# Altium project ESP32RemoteController.PrjPcb
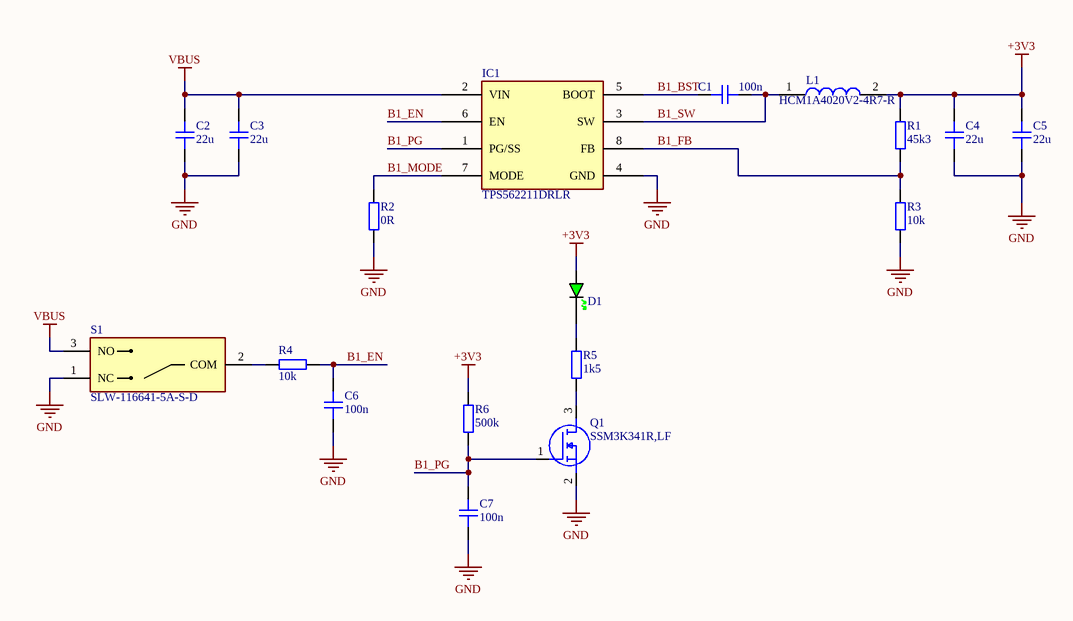
[diagram p0: Power.SchDoc]
3 sheets, 77 parts. Net scope: global (net labels, ports and power ports of the same name join across sheets).
Board file: RemoteControllerDesign.PcbDoc
Sheets:
  Power.SchDoc
  SoC.SchDoc
  Connections.SchDoc

## Sheet Power.SchDoc
size A4; SheetNumber: 1; SheetTotal: 3

### Parts
C1  100n  [CAP_0402]
C2  22u  [CAP_0603]
C3  22u  [CAP_0603]
C4  22u  [CAP_0603]
C5  22u  [CAP_0603]
C6  100n  [CAP_0402]
C7  100n  [CAP_0402]
D1  GREEN  [LED_0603_GREEN]  (value not drawn)
IC1  TPS562211DRLR  [SOTFL50P160X60-8N]
L1  HCM1A4020V2-4R7-R  [INDPM4442X200N]
Q1  SSM3K341R,LF  [SOTFL95P240X88-3N]
R1  45k3  [RES_0402]
R2  0R  [RES_0402]
R3  10k  [RES_0402]
R4  10k  [RES_0402]
R5  1k5  [RES_0603]
R6  500k  [RES_0402]
S1  SLW-116641-5A-S-D  [SLW1166415ASD]

### Nets
+3V3: C4.2 C5.2 D1.A L1.2 R1.2 R6.2
GND: C2.1 C3.1 C4.1 C5.1 C6.2 C7.2 IC1.4(GND) Q1.2(S) R2.1 R3.1 S1.1(NC)
VBUS: C2.2 C3.2 IC1.2(VIN) S1.3(NO)
B1_BST: C1.2 IC1.5(BOOT)
B1_EN: C6.1 IC1.6(EN) R4.1
B1_FB: IC1.8(FB) R1.1 R3.2
B1_MODE: IC1.7(MODE) R2.2
B1_PG: C7.1 IC1.1(PG/SS) Q1.1(G) R6.1
B1_SW: C1.1 IC1.3(SW) L1.1
NetD1_K: D1.K R5.2
NetQ1_3: Q1.3(D) R5.1
NetR4_2: R4.2 S1.2(COM)

### Library data of the parts
C1 C6 C7 = CAP_0402: Capacitor SMD 0402; Manufacturer: *; Manufacturer Part Number: *; Distributor Link: *; LCSC: *; Rating: *; Dielectric: *
C2-C5 = CAP_0603: Capacitor SMD 0603; Manufacturer: *; Manufacturer Part Number: *; Distributor Link: *; LCSC: *; Rating: *; Dielectric: *
D1 = LED_0603_GREEN: LED 0603 GREEN SMD
IC1 = TPS562211DRLR: Integrated Circuit; Manufacturer_Name: Texas Instruments; Datasheet Link: https://www.ti.com/lit/gpn/tps562211?HQS=ti-null-null-sf-df-pf-sep-wwe&DCM=yes; Height: 0.6mm; Manufacturer_Part_Number: TPS562211DRLR; Mouser Part Number: 595-TPS562211DRLR; Mouser Price/Stock: https://www.mouser.co.uk/ProductDetail/Texas-Instruments/TPS562211DRLR?qs=QNEnbhJQKvbGZDTBa5sjbg%3D%3D
L1 = HCM1A4020V2-4R7-R: Inductor; Manufacturer_Name: Eaton; Datasheet Link: https://www.eaton.com/content/dam/eaton/products/electronic-components/resources/data-sheet/eaton-hcm1a4020v2-automotive-power-inductor-data-sheet.pdf; Height: 2mm; Manufacturer_Part_Number: HCM1A4020V2-4R7-R; Mouser Part Number: 504-HCM1A4020V24R7-R; Mouser Price/Stock: https://www.mouser.co.uk/ProductDetail/Coiltronics-Eaton/HCM1A4020V2-4R7-R?qs=XeJtXLiO41Tld1UV9xSCUQ%3D%3D; Arrow Part Number: HCM1A4020V2-4R7-R; Arrow Price/Stock: https://www.arrow.com/en/products/hcm1a4020v2-4r7-r/eaton?region=nac
Q1 = SSM3K341R,LF: MOSFET (N-Channel); Manufacturer_Name: Toshiba; Datasheet Link: https://toshiba.semicon-storage.com/info/docget.jsp?did=35714&prodName=SSM3K341R; Height: 0.88mm; Manufacturer_Part_Number: SSM3K341R,LF; Mouser Part Number: 757-SSM3K341RLF; Mouser Price/Stock: https://www.mouser.co.uk/ProductDetail/Toshiba/SSM3K341RLF?qs=PDgMCp4xDJYlECuIdOFceQ%3D%3D; Arrow Part Number: SSM3K341R,LF; Arrow Price/Stock: https://www.arrow.com/en/products/ssm3k341rlf/toshiba?region=nac
R1-R4 R6 = RES_0402: Resistor SMD 0402; Manufacturer: *; Manufacturer Part Number: *; Distributor Link: *; LCSC: *
R5 = RES_0603: Resistor SMD 0603; Manufacturer: *; Manufacturer Part Number: *; Distributor Link: *; LCSC: *
S1 = SLW-116641-5A-S-D: Switch; Manufacturer_Name: Same Sky; Datasheet Link: https://www.sameskydevices.com/product/resource/supplyframepdf/slw-116641-5a-s-d.pdf; Height: 11.3mm; Manufacturer_Part_Number: SLW-116641-5A-S-D; Mouser Part Number: 179-SLW1166415ASD; Mouser Price/Stock: https://www.mouser.co.uk/ProductDetail/Same-Sky/SLW-116641-5A-S-D?qs=IKkN%2F947nfBZSdW8n5Vqgw%3D%3D

## Sheet SoC.SchDoc
size A4; SheetNumber: 2; SheetTotal: 3
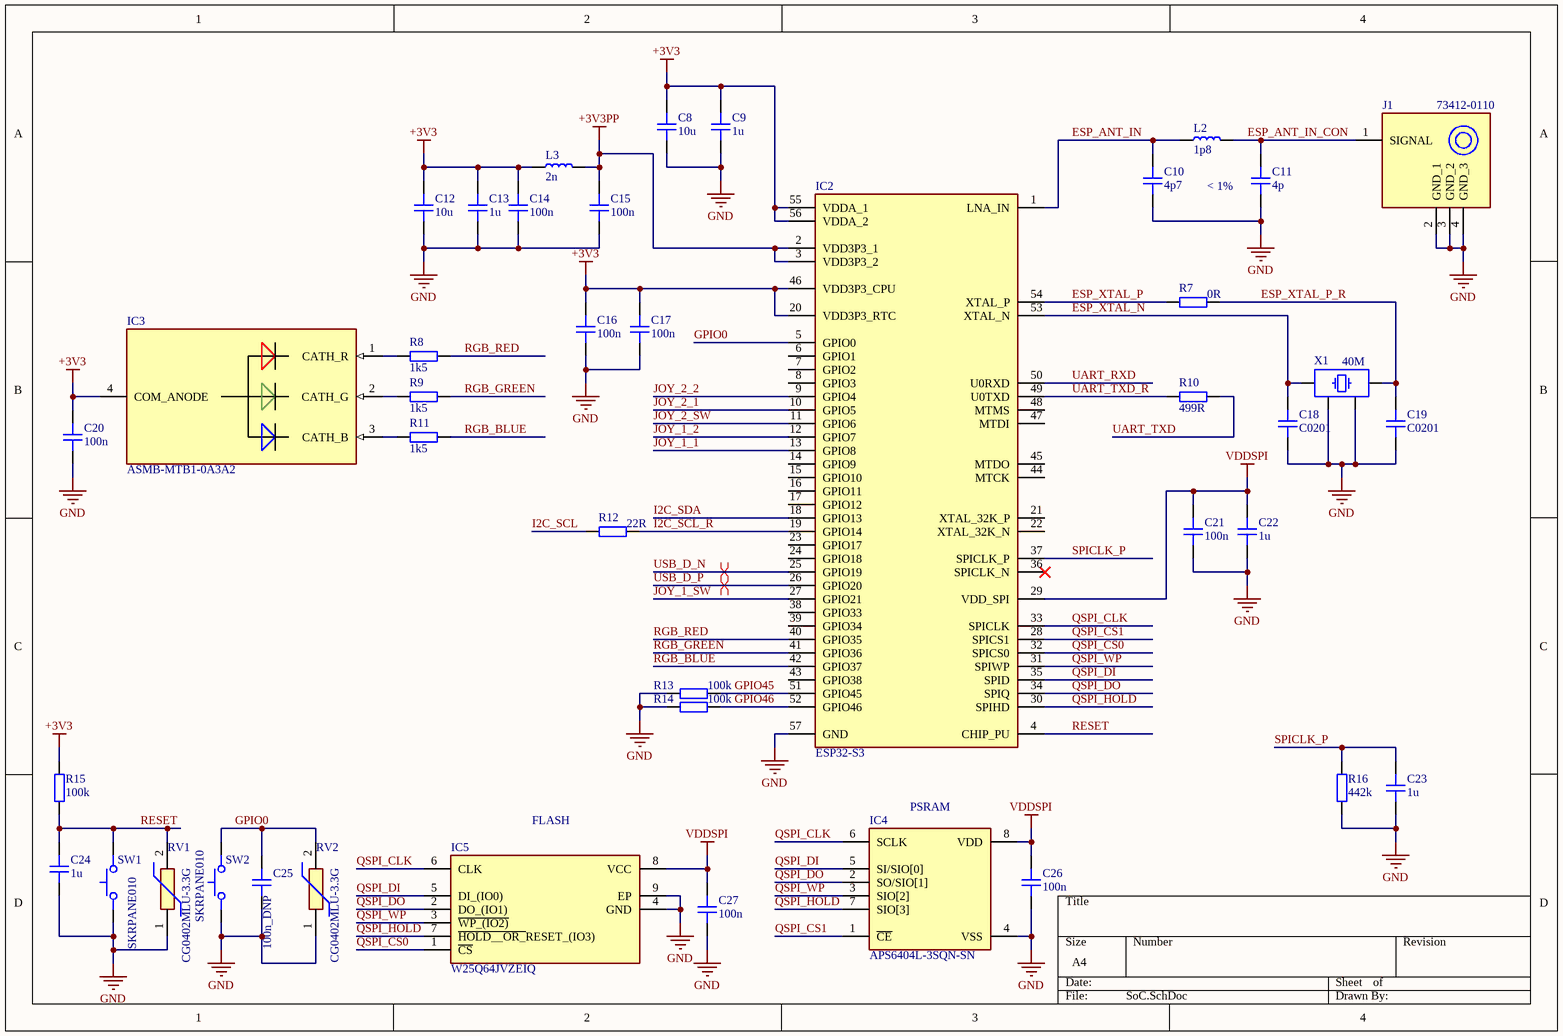
[diagram p1: SoC.SchDoc]

### Parts
C8  10u  [CAP_0402]
C9  1u  [CAP_0201]
C10  4p7  [CAP_0201]
C11  4p  [CAP_0201]
C12  10u  [CAP_0402]
C13  1u  [CAP_0201]
C14  100n  [CAP_0201]
C15  100n  [CAP_0201]
C16  100n  [CAP_0201]
C17  100n  [CAP_0201]
C18  C0201  [CAP_0201]
C19  C0201  [CAP_0201]
C20  100n  [CAP_0201]
C21  100n  [CAP_0201]
C22  1u  [CAP_0201]
C23  1u  [CAP_0201]
C24  1u  [CAP_0201]
C25  100n_DNP  [CAP_0201]
C26  100n  [CAP_0201]
C27  100n  [CAP_0201]
IC2  ESP32-S3  [ESP32QFN40P700X700X90-57N-D]
IC3  ASMB-MTB1-0A3A2  [AVAGO_PLCC4]
IC4  APS6404L-3SQN-SN  [SOIC127P600X175-8N - duplicate]
IC5  W25Q64JVZEIQ  [SON127P800X600X80-9N-D]
J1  73412-0110  [73412-0110]
L2  1p8  [IND_0201]
L3  2n  [IND_0201]
R7  0R  [RES_0201]
R8  1k5  [RES_0402]
R9  1k5  [RES_0402]
R10  499R  [RES_0201]
R11  1k5  [RES_0402]
R12  22R  [RES_0201]
R13  100k  [RES_0201]
R14  100k  [RES_0201]
R15  100k  [RES_0201]
R16  442k  [RES_0201]
RV1  CG0402MLU-3.3G  [VARC1005X41N]
RV2  CG0402MLU-3.3G  [VARC1005X41N]
SW1  SKRPANE010  [SKRPANE010]
SW2  SKRPANE010  [SKRPANE010]
X1  40M  [XTAL_2016]

### Nets
+3V3: C8.2 C9.2 C12.2 C13.2 C14.2 C16.2 C17.2 C20.2 IC2.20(VDD3P3_RTC) IC2.46(VDD3P3_CPU) IC2.55(VDDA_1) IC2.56(VDDA_2) IC3.4(COM_ANODE) L3.1 R15.2
+3V3PP: C15.2 IC2.2(VDD3P3_1) IC2.3(VDD3P3_2) L3.2
GND: C8.1 C9.1 C10.1 C11.1 C12.1 C13.1 C14.1 C15.1 C16.1 C17.1 C18.1 C19.1 C20.1 C21.1 C22.1 C23.1 C24.1 C25.1 C26.1 C27.1 IC2.57(GND) IC4.4(VSS) IC5.4(GND) IC5.9(EP) J1.2(GND_1) J1.3(GND_2) J1.4(GND_3) R13.2 R14.2 R16.1 RV1.1 RV2.1 SW1.12 SW2.12 X1.2 X1.4
VDDSPI: C21.2 C22.2 C26.2 C27.2 IC2.29(VDD_SPI) IC4.8(VDD) IC5.8(VCC)
ESP_ANT_IN: C10.2 IC2.1(LNA_IN) L2.1
ESP_ANT_IN_CON: C11.2 J1.1(SIGNAL) L2.2
ESP_XTAL_N: C18.2 IC2.53(XTAL_N) X1.1
ESP_XTAL_P: IC2.54(XTAL_P) R7.2
ESP_XTAL_P_R: C19.2 R7.1 X1.3
GPIO0: C25.2 IC2.5(GPIO0) RV2.2 SW2.34
GPIO45: IC2.51(GPIO45) R13.1
GPIO46: IC2.52(GPIO46) R14.1
I2C_SCL: R12.2
I2C_SCL_R: IC2.19(GPIO14) R12.1
I2C_SDA: IC2.18(GPIO13)
JOY_1_1: IC2.13(GPIO8)
JOY_1_2: IC2.12(GPIO7)
JOY_1_SW: IC2.27(GPIO21)
JOY_2_1: IC2.10(GPIO5)
JOY_2_2: IC2.9(GPIO4)
JOY_2_SW: IC2.11(GPIO6)
QSPI_CLK: IC2.33(SPICLK) IC4.6(SCLK) IC5.6(CLK)
QSPI_CS0: IC2.32(SPICS0) IC5.1(~{CS})
QSPI_CS1: IC2.28(SPICS1) IC4.1(~{CE})
QSPI_DI: IC2.35(SPID) IC4.5(SI/SIO[0]) IC5.5(DI_(IO0))
QSPI_DO: IC2.34(SPIQ) IC4.2(SO/SIO[1]) IC5.2(DO_(IO1))
QSPI_HOLD: IC2.30(SPIHD) IC4.7(SIO[3]) IC5.7(~{HOLD__OR_}RESET_(IO3))
QSPI_WP: IC2.31(SPIWP) IC4.3(SIO[2]) IC5.3(~{WP_(IO2)})
RESET: C24.2 IC2.4(CHIP_PU) R15.1 RV1.2 SW1.34
RGB_BLUE: IC2.42(GPIO37) R11.2
RGB_GREEN: IC2.41(GPIO36) R9.2
RGB_RED: IC2.40(GPIO35) R8.2
SPICLK_P: C23.2 IC2.37(SPICLK_P) R16.2
UART_RXD: IC2.50(U0RXD)
UART_TXD: R10.1
UART_TXD_R: IC2.49(U0TXD) R10.2
USB_D_N: IC2.25(GPIO19)
USB_D_P: IC2.26(GPIO20)
NetIC3_1: IC3.1(CATH_R) R8.1
NetIC3_2: IC3.2(CATH_G) R9.1
NetIC3_3: IC3.3(CATH_B) R11.1

Not connected (* = marked no-connect by the designer): IC2 6(GPIO1) 7(GPIO2) 8(GPIO3) 14(GPIO9) 15(GPIO10) 16(GPIO11) 17(GPIO12) 21(XTAL_32K_P) 22(XTAL_32K_N) 23(GPIO17) 24(GPIO18) 36(SPICLK_N)* 38(GPIO33) 39(GPIO34) 43(GPIO38) 44(MTCK) 45(MTDO) 47(MTDI) 48(MTMS)

### Layout directives
differential pair: USB_D_N, USB_D_P

### Notes on the sheet
- < 1%
- (near IC5) FLASH
- (near IC4) PSRAM

### Library data of the parts
C8 C12 = CAP_0402: Capacitor SMD 0402; Manufacturer: *; Manufacturer Part Number: *; Distributor Link: *; LCSC: *; Rating: *; Dielectric: *
C9-C11 C13-C27 = CAP_0201: Capacitor SMD 0201; Manufacturer: *; Manufacturer Part Number: *; Distributor Link: *; LCSC: *; Rating: *; Dielectric: *
IC2 = ESP32-S3: Integrated Circuit; Manufacturer_Name: Espressif Systems; Datasheet Link: https://nl.mouser.com/datasheet/2/891/Espressif_ESP32_S3_Datasheet-2904763.pdf; Height: 0.9mm; Manufacturer_Part_Number: ESP32-S3; Mouser Part Number: 356-ESP32-S3; Mouser Price/Stock: https://www.mouser.co.uk/ProductDetail/Espressif-Systems/ESP32-S3?qs=Rp5uXu7WBW%2FNWuUy%252BBihNw%3D%3D
IC3 = ASMB-MTB1-0A3A2: Integrated Circuit; Manufacturer_Name: Avago Technologies; Datasheet Link: https://docs.broadcom.com/docs/AV02-4194EN; Manufacturer_Part_Number: ASMB-MTB1-0A3A2; Mouser Part Number: 630-ASMB-MTB1-0A3A2; Mouser Price/Stock: https://www.mouser.co.uk/ProductDetail/Broadcom-Avago/ASMB-MTB1-0A3A2?qs=ToP8pWlZ0bM7NIiOojjztA%3D%3D
IC4 = APS6404L-3SQN-SN: Integrated Circuit; Manufacturer_Name: AP Memory; Datasheet Link: https://www.apmemory.com/wp-content/uploads/APM_PSRAM_E3_QSPI-APS6404L-3SQN-v2.4-KGD_PKG.pdf; Height: 1.75mm; Manufacturer_Part_Number: APS6404L-3SQN-SN; Mouser Part Number: 878-APS6404L-3SQN-SN; Mouser Price/Stock: https://www.mouser.co.uk/ProductDetail/AP-Memory/APS6404L-3SQN-SN?qs=IS%252B4QmGtzzqCot9%252BeIJwKw%3D%3D
IC5 = W25Q64JVZEIQ: Integrated Circuit; Manufacturer_Name: Winbond; Datasheet Link: https://www.winbond.com/hq/search-resource-file.jsp?partNo=W25Q64JVZEIQ&type=datasheet; Height: 0.8mm; Manufacturer_Part_Number: W25Q64JVZEIQ; Mouser Part Number: 454-W25Q64JVZEIQ; Mouser Price/Stock: https://www.mouser.co.uk/ProductDetail/Winbond/W25Q64JVZEIQ?qs=qSfuJ%252Bfl%2Fd5SLf3zhXauzA%3D%3D; Arrow Part Number: W25Q64JVZEIQ; Arrow Price/Stock: https://www.arrow.com/en/products/w25q64jvzeiq/winbond-electronics?utm_currency=USD&region=nac
J1 = 73412-0110: Connector; Manufacturer_Name: Molex; Datasheet Link: http://www.molex.com/pdm_docs/sd/734120110_sd.pdf; Manufacturer_Part_Number: 73412-0110; Mouser Part Number: 538-73412-0110; Mouser Price/Stock: https://www.mouser.co.uk/ProductDetail/Molex/73412-0110?qs=NlNVDDZd7xQHV8e0ilpSdQ%3D%3D; Arrow Part Number: 73412-0110; Arrow Price/Stock: https://www.arrow.com/en/products/73412-0110/molex?region=nac
L2 L3 = IND_0201: Inductor SMD 0201; Manufacturer_Name: Murata Electronics; Manufacturer_Part_Number: LQP03HQ56NH02D; Datasheet Link: https://psearch.en.murata.com/inductor/product/LQP03HQ56NH02%23.html; Height: 0.42mm; Mouser Part Number: 81-LQP03HQ56NH02D; Mouser Price/Stock: https://www.mouser.co.uk/ProductDetail/Murata-Electronics/LQP03HQ56NH02D?qs=B6kkDfuK7%2FBQu1Ob9%2FT2Bg%3D%3D
R7 R10 R12-R16 = RES_0201: Resistor SMD 0201; Manufacturer: *; Manufacturer Part Number: *; Distributor Link: *; LCSC: *
R8 R9 R11 = RES_0402: Resistor SMD 0402; Manufacturer: *; Manufacturer Part Number: *; Distributor Link: *; LCSC: *
RV1 RV2 = CG0402MLU-3.3G: ESD Diode; Manufacturer_Name: Bourns; Datasheet Link: https://www.bourns.com/docs/Product-Datasheets/MLU.pdf; Height: 0.41mm; Manufacturer_Part_Number: CG0402MLU-3.3G; Mouser Part Number: 652-CG0402MLU-3.3G; Mouser Price/Stock: https://www.mouser.co.uk/ProductDetail/Bourns/CG0402MLU-3.3G?qs=m8myXnDJXpWVM8EQWErxtQ%3D%3D; Arrow Part Number: CG0402MLU-3.3G; Arrow Price/Stock: https://www.arrow.com/en/products/cg0402mlu-3.3g/bourns?utm_currency=USD&region=nac
SW1 SW2 = SKRPANE010: Tactile Switch SMD SPST; Manufacturer: Alps Alpine; Manufacturer Part Number: SKRPANE010
X1 = XTAL_2016: Crystal SMD 4-Pin 2.0x1.6mm; Distributor Link: *

## Sheet Connections.SchDoc
size A4; SheetNumber: 3; SheetTotal: 3
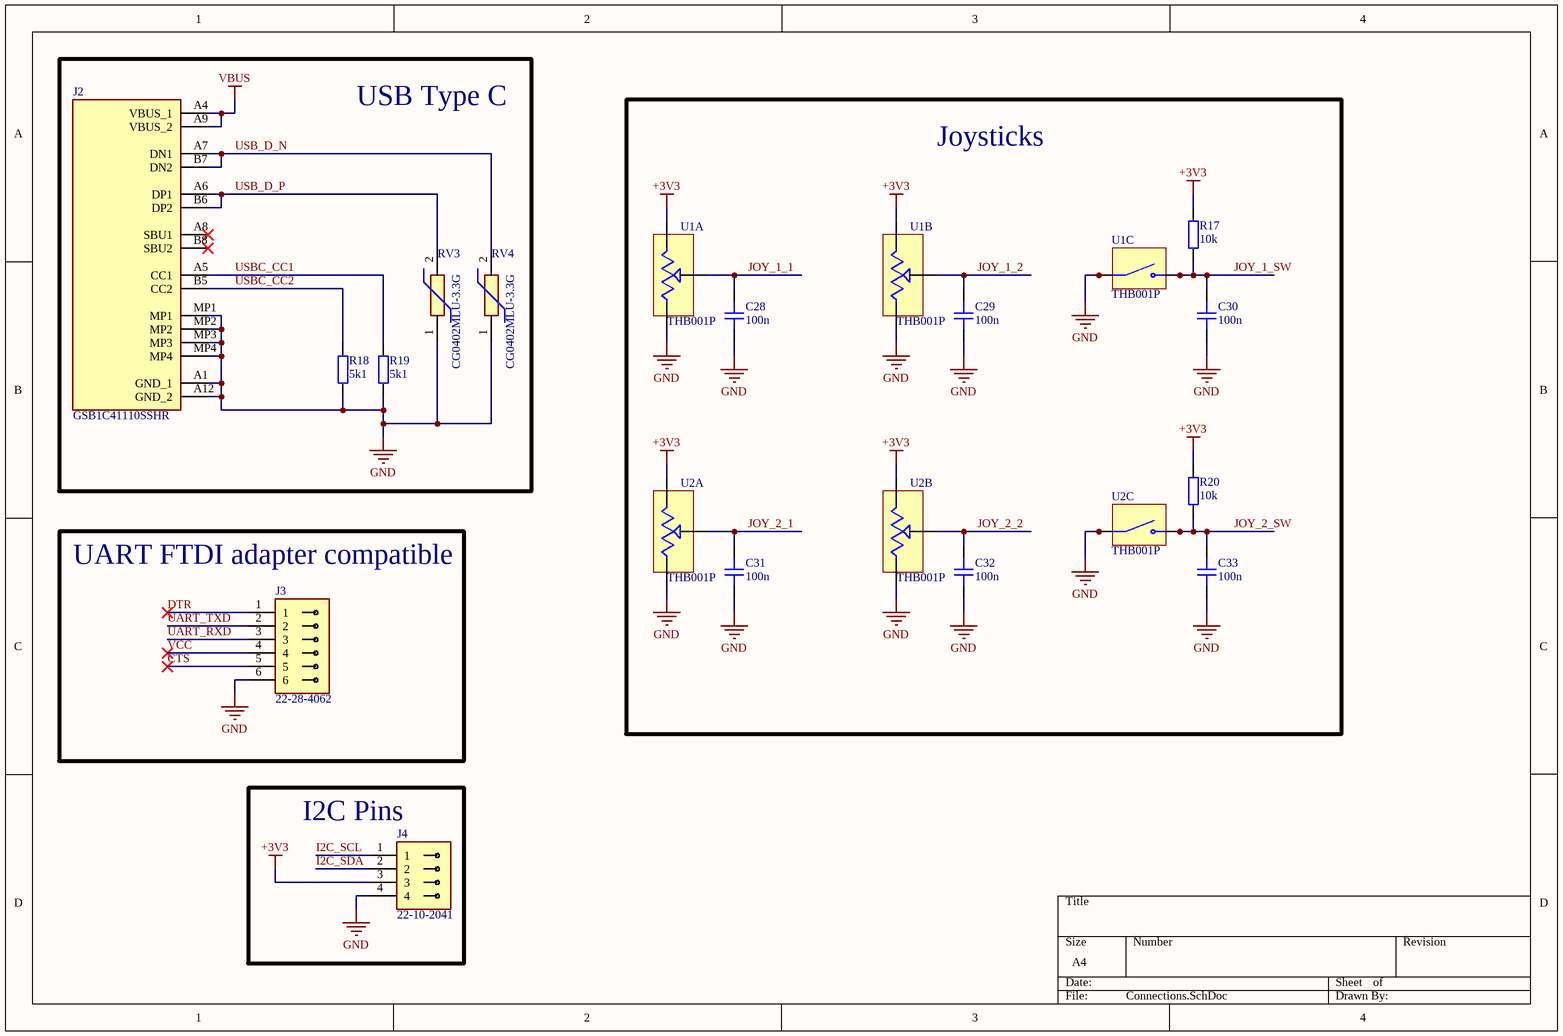
[diagram p2: Connections.SchDoc]

### Parts
C28  100n  [CAP_0402]
C29  100n  [CAP_0402]
C30  100n  [CAP_0402]
C31  100n  [CAP_0402]
C32  100n  [CAP_0402]
C33  100n  [CAP_0402]
J2  GSB1C41110SSHR  [GSB1C41110SSHR]
J3  22-28-4062  [HDRV6W66P0X254_1X6_1524X249X838P]
J4  22-10-2041  [HDRV4W67P0X254_1X4_991X236X1117P]
R17  10k  [RES_0402]
R18  5k1  [RES_0402]
R19  5k1  [RES_0402]
R20  10k  [RES_0402]
RV3  CG0402MLU-3.3G  [VARC1005X41N]
RV4  CG0402MLU-3.3G  [VARC1005X41N]
U1  THB001P  [CNK_THB001P]  (parts A,B,C of 3)
U2  THB001P  [CNK_THB001P]  (parts A,B,C of 3)

### Blocks framed on the sheet
USB Type C: J2 R18 R19 RV3 RV4
Joysticks: C28-C33 R17 R20 U1 U2
UART FTDI adapter compatible: J3
I2C Pins: J4

### Nets
+3V3: J4.3 R17.1 R20.1 U1.VR1_1 U1.VR2_1 U2.VR1_1 U2.VR2_1
GND: C28.2 C29.2 C30.2 C31.2 C32.2 C33.2 J2.A1(GND_1) J2.A12(GND_2) J2.MP1 J2.MP2 J2.MP3 J2.MP4 J3.6 J4.4 R18.1 R19.1 RV3.1 RV4.1 U1.C(COM) U1.D(COM) U1.VR1_3 U1.VR2_3 U2.C(COM) U2.D(COM) U2.VR1_3 U2.VR2_3
VBUS: J2.A4(VBUS_1) J2.A9(VBUS_2)
CTS: J3.5
DTR: J3.1
I2C_SCL: J4.1
I2C_SDA: J4.2
JOY_1_1: C28.1 U1.VR1_2
JOY_1_2: C29.1 U1.VR2_2
JOY_1_SW: C30.1 R17.2 U1.A(NO) U1.B(NO)
JOY_2_1: C31.1 U2.VR1_2
JOY_2_2: C32.1 U2.VR2_2
JOY_2_SW: C33.1 R20.2 U2.A(NO) U2.B(NO)
UART_RXD: J3.3
UART_TXD: J3.2
USB_D_N: J2.A7(DN1) J2.B7(DN2) RV4.2
USB_D_P: J2.A6(DP1) J2.B6(DP2) RV3.2
USBC_CC1: J2.A5(CC1) R19.2
USBC_CC2: J2.B5(CC2) R18.2
VCC: J3.4

Not connected (* = marked no-connect by the designer): J2 A8(SBU1)* B8(SBU2)*

### Library data of the parts
C28-C33 = CAP_0402: Capacitor SMD 0402; Manufacturer: *; Manufacturer Part Number: *; Distributor Link: *; LCSC: *; Rating: *; Dielectric: *
J2 = GSB1C41110SSHR: Connector; Manufacturer_Name: Amphenol Communications Solutions; Datasheet Link: https://cdn.amphenol-cs.com/media/wysiwyg/files/drawing/gsb1c41x10sshr-ax1.pdf; Height: 3.41mm; Manufacturer_Part_Number: GSB1C41110SSHR
J3 = 22-28-4062: Connector; Manufacturer_Name: Molex; Datasheet Link: https://datasheet.datasheetarchive.com/originals/distributors/SFDatasheet-1/sf-00031037.pdf; Height: 8.38mm; Manufacturer_Part_Number: 22-28-4062; Mouser Part Number: 538-22-28-4062; Mouser Price/Stock: https://www.mouser.com/Search/Refine.aspx?Keyword=538-22-28-4062
J4 = 22-10-2041: Connector; Manufacturer_Name: Molex; Datasheet Link: https://www.molex.com/en-us/products/part-detail/22102041?display=pdf; Height: 11.17mm; Manufacturer_Part_Number: 22-10-2041; Mouser Part Number: 538-22-10-2041; Mouser Price/Stock: https://www.mouser.co.uk/ProductDetail/Molex/22-10-2041?qs=I2tGkhXPHwPlInpHG6ZNmQ%3D%3D
R17-R20 = RES_0402: Resistor SMD 0402; Manufacturer: *; Manufacturer Part Number: *; Distributor Link: *; LCSC: *
RV3 RV4 = CG0402MLU-3.3G: ESD Diode; Manufacturer_Name: Bourns; Datasheet Link: https://www.bourns.com/docs/Product-Datasheets/MLU.pdf; Height: 0.41mm; Manufacturer_Part_Number: CG0402MLU-3.3G; Mouser Part Number: 652-CG0402MLU-3.3G; Mouser Price/Stock: https://www.mouser.co.uk/ProductDetail/Bourns/CG0402MLU-3.3G?qs=m8myXnDJXpWVM8EQWErxtQ%3D%3D; Arrow Part Number: CG0402MLU-3.3G; Arrow Price/Stock: https://www.arrow.com/en/products/cg0402mlu-3.3g/bourns?utm_currency=USD&region=nac
U1 U2 = THB001P: Joystick, 2 - Axis Analog (Resistive) Output; MF: C&K; Price: None; Availability: In Stock; MP: THB001P; Package: None; SnapEDA_Link: https://www.snapeda.com/parts/THB001P/C%2526K/view-part/?ref=snap; Check_prices: https://www.snapeda.com/parts/THB001P/C%2526K/view-part/?ref=eda; Value: *; Purchase-URL: https://pricing.snapeda.com/search/part/THB001P/?ref=eda

## Nets that join several sheets
+3V3: Power (6 pins), SoC (15 pins), Connections (7 pins)
GND: Power (11 pins), SoC (36 pins), Connections (26 pins)
VBUS: Power (C2.2 C3.2 IC1.2 S1.3), Connections (J2.A4 J2.A9)
I2C_SCL: SoC (R12.2), Connections (J4.1)
I2C_SDA: SoC (IC2.18), Connections (J4.2)
JOY_1_1: SoC (IC2.13), Connections (C28.1 U1.VR1_2)
JOY_1_2: SoC (IC2.12), Connections (C29.1 U1.VR2_2)
JOY_1_SW: SoC (IC2.27), Connections (C30.1 R17.2 U1.A U1.B)
JOY_2_1: SoC (IC2.10), Connections (C31.1 U2.VR1_2)
JOY_2_2: SoC (IC2.9), Connections (C32.1 U2.VR2_2)
JOY_2_SW: SoC (IC2.11), Connections (C33.1 R20.2 U2.A U2.B)
UART_RXD: SoC (IC2.50), Connections (J3.3)
UART_TXD: SoC (R10.1), Connections (J3.2)
USB_D_N: SoC (IC2.25), Connections (J2.A7 J2.B7 RV4.2)
USB_D_P: SoC (IC2.26), Connections (J2.A6 J2.B6 RV3.2)